# EAGLE design bt (EAGLE 6.4)
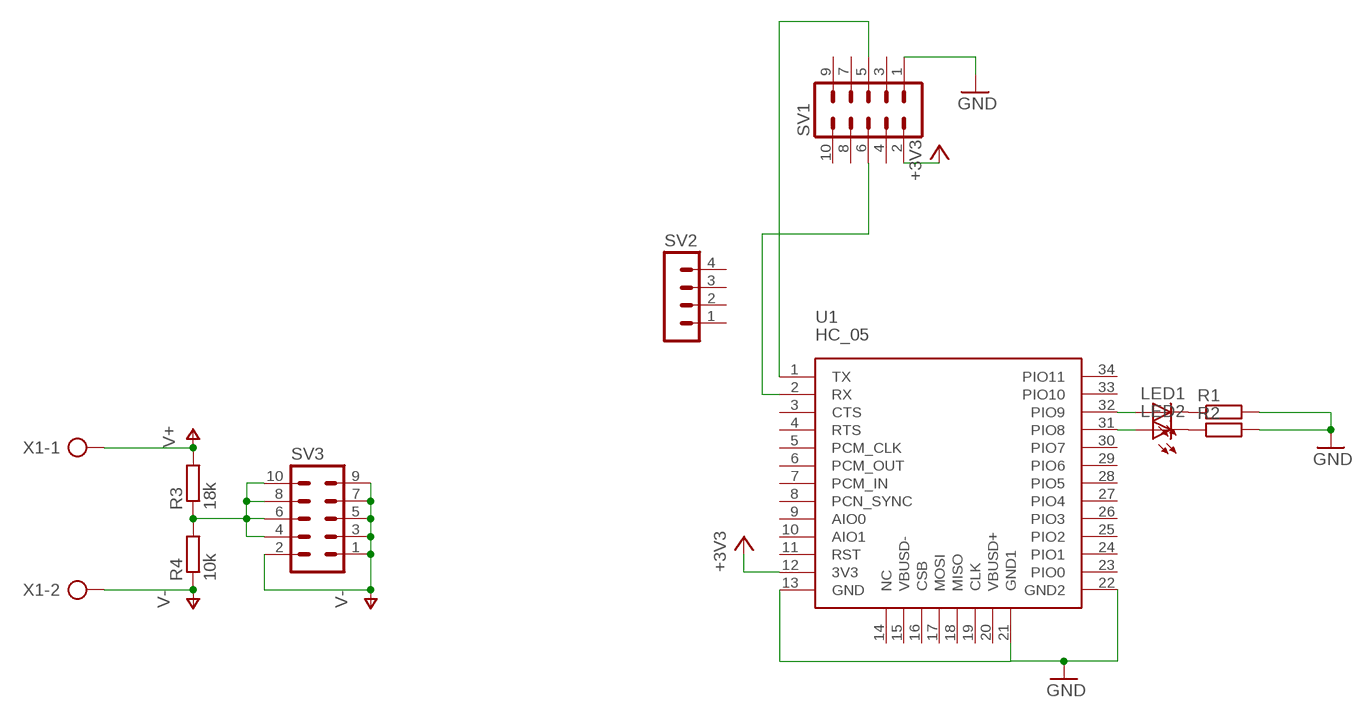
[diagram p0: schematic, sheet 1]

## Parts
LED1  LED3MM  [LED3MM]
LED2  LED3MM  [LED3MM]
R1  R-EU_R0805  [R0805]
R2  R-EU_R0805  [R0805]
R3  18k  R-EU_R0805  [R0805]
R4  10k  R-EU_R0805  [R0805]
SV1  ML10  [ML10]
SV2  MA04-1  [MA04-1]
SV3  ML10  [ML10]
U1  HC_05  [BLUETOOTH_SMD]
X1  AK500/2  [AK500/2]

## Nets
+3V3: SV1.2 U1.12(3V3)
GND: R1.2 R2.2 SV1.1 U1.13(GND) U1.21(GND1) U1.22(GND2)
N$1: SV1.5 U1.1(TX)
N$2: SV1.6 U1.2(RX)
N$3: LED1.K(C) R1.1
N$4: LED2.K(C) R2.1
N$5: LED2.A U1.31(PIO8)
N$6: LED1.A U1.32(PIO9)
N$9: R3.1 R4.2 SV3.4 SV3.6 SV3.8 SV3.10
V+: R3.2 X1.1
V-: R4.1 SV3.1 SV3.2 SV3.3 SV3.5 SV3.7 SV3.9 X1.2
Unconnected: SV1.3 SV1.4 SV1.7 SV1.8 SV1.9 SV1.10 SV2.1 SV2.2 SV2.3 SV2.4 U1.3(CTS) U1.4(RTS) U1.5(PCM_CLK) U1.6(PCM_OUT) U1.7(PCM_IN) U1.8(PCN_SYNC) U1.9(AIO0) U1.10(AIO1) U1.11(RST) U1.14(NC) U1.15(VBUSD-) U1.16(CSB) U1.17(MOSI) U1.18(MISO) U1.19(CLK) U1.20(VBUSD+) U1.23(PIO0) U1.24(PIO1) U1.25(PIO2) U1.26(PIO3) U1.27(PIO4) U1.28(PIO5) U1.29(PIO6) U1.30(PIO7) U1.33(PIO10) U1.34(PIO11)

## Library data of the parts
LED1 LED2 = led:LED: LED OSRAM: - CHIPLED LG R971, LG N971, LY N971, LG Q971, LY Q971, LO R971, LY R971 LH N974, LH R974 LS Q976, LO Q976, LY Q976 LO Q996 - Hyper CHIPLED LW Q18S LB Q993, LB Q99A, LB R99A - SideLED LS A670, LO A670, LY A670, LG A670, LP A670 LB A673, LV A673, LT A673, LW A673 LH A674 LY A675 LS A676, LA A676, LO A676, LY A676, LW A676 LS A679, LY A679, LG A679 - Hyper Micro SIDELED® LS Y876, LA Y876, LO Y876, LY Y876 LT Y87S - SmartLED LW L88C, LW L88S LB L89C, LB L89S, LG L890 LS L89K, LO L89K, LY L89K LS L896, LA L896, LO L896, LY L896 - TOPLED LS T670, LO T670, LY T670, LG T670, LP T670 LSG T670, LSP T670, LSY T670, LOP T670, LYG T670 LG T671, LOG T671, LSG T671 LB T673, LV T673, LT T673, LW T673 LH T674 LS T676, LA T676, LO T676, LY T676, LB T676, LH T676, LSB T676, LW T676 LB T67C, LV T67C, LT T67C, LS T67K, LO T67K, LY T67K, LW E67C LS E67B, LA E67B, LO E67B, LY E67B, LB E67C, LV E67C, LT E67C LW T67C LS T679, LY T679, LG T679 LS T770, LO T770, LY T770, LG T770, LP T770 LB T773, LV T773, LT T773, LW T773 LH T774 LS E675, LA E675, LY E675, LS T675 LS T776, LA T776, LO T776, LY T776, LB T776 LHGB T686 LT T68C, LB T68C - Hyper Mini TOPLED® LB M676 - Mini TOPLED Santana® LG M470 LS M47K, LO M47K, LY M47K Source: http://www.osram.convergy.de LUXEON: - LUMILED® LXK2-PW12-R00, LXK2-PW12-S00, LXK2-PW14-U00, LXK2-PW14-V00 LXK2-PM12-R00, LXK2-PM12-S00, LXK2-PM14-U00 LXK2-PE12-Q00, LXK2-PE12-R00, LXK2-PE12-S00, LXK2-PE14-T00, LXK2-PE14-U00 LXK2-PB12-K00, LXK2-PB12-L00, LXK2-PB12-M00, LXK2-PB14-N00, LXK2-PB14-P00, LXK2-PB14-Q00 LXK2-PR12-L00, LXK2-PR12-M00, LXK2-PR14-Q00, LXK2-PR14-R00 LXK2-PD12-Q00, LXK2-PD12-R00, LXK2-PD12-S00 LXK2-PH12-R00, LXK2-PH12-S00 LXK2-PL12-P00, LXK2-PL12-Q00, LXK2-PL12-R00 Source: www.luxeon.com KINGBRIGHT: KA-3528ASYC Source: www.kingbright.com
R1-R4 = resistor:R-EU_: RESISTOR, European symbol
SV1 SV3 = con-harting-ml:ML10: HARTING; OC_FARNELL: unknown; OC_NEWARK: unknown
SV2 = con-lstb:MA04-1: PIN HEADER; OC_FARNELL: unknown; OC_NEWARK: unknown
U1 = SerialPortBluetooth:HC_05
X1 = con-ptr500:AK500/2: CONNECTOR; OC_FARNELL: unknown; OC_NEWARK: unknown

## Board
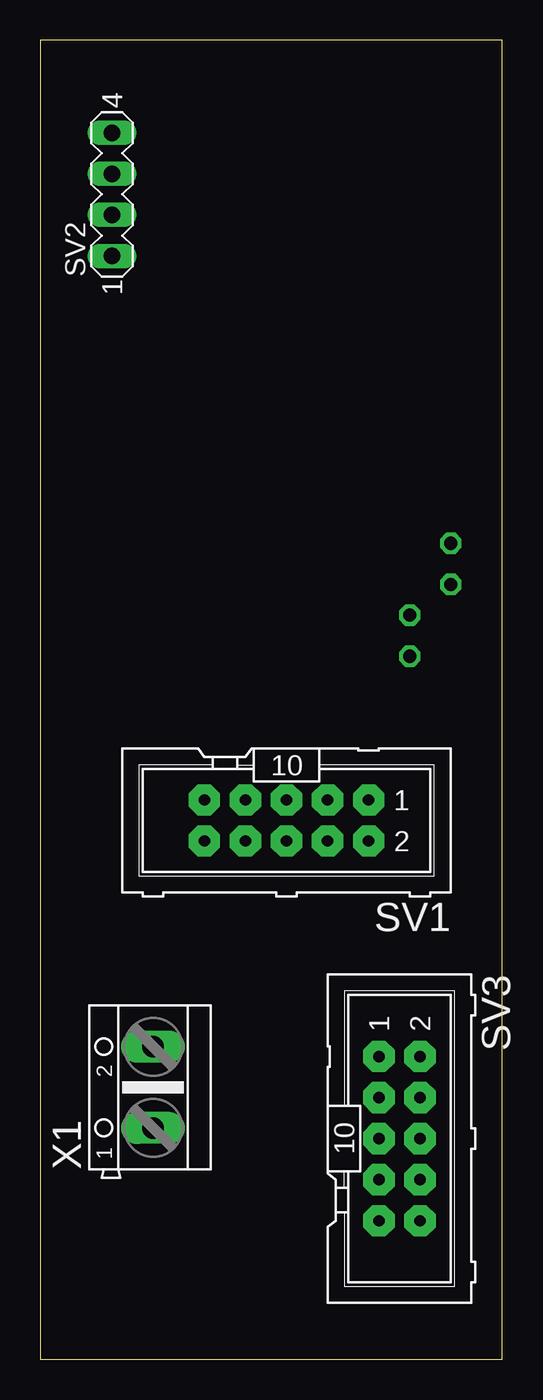
[diagram p1: board, top side]
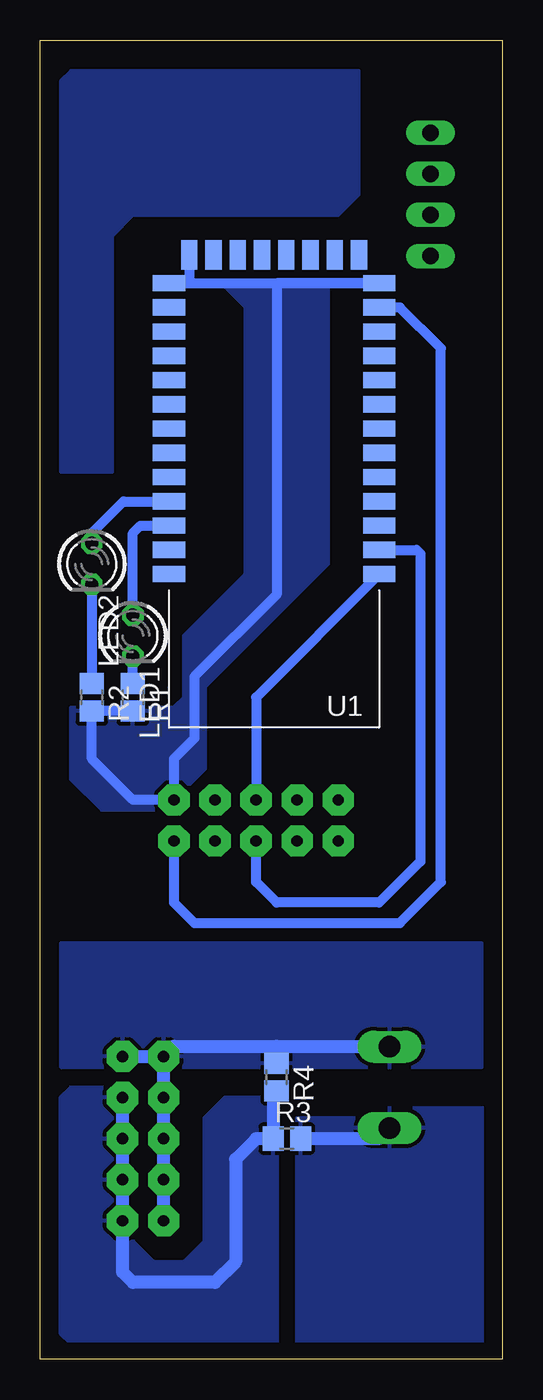
[diagram p2: board, bottom side, seen from below]

Size 28.55 x 81.59 mm. Coordinates in mm from the lower left corner, seen from the top.
Outline: 28.55,81.59 0,81.59 0,0 28.55,0 28.55,81.59
Copper layers (1*16): Top 0.035mm / dielectric 1.5mm / Bottom 0.035mm
Design rules "default": minimum track width 10mil, minimum drill 24mil, track to track 8mil, track to pad 8mil, pad to pad 8mil, via to via 8mil, smd to smd 8mil, copper to edge 40mil, drill to drill 8mil, minimum pad ring 10mil, minimum via ring 8mil, stop-mask expansion 4mil, vias tented up to drill 0mil, thermal gap 10mil

### Footprints (pad centres in the part's own frame; a part is rotated, then mirrored left to right if it is on the bottom)
LED3MM = drill 0.813 octagon: A -1.27,0; K 1.27,0
R0805 = smd 1.3 x 1.5: 1 -0.85,0; 2 0.85,0
ML10 = drill 0.7 pad 1.93 octagon: 1 -5.08,-1.27; 2 -5.08,1.27; 3 -2.54,-1.27; 4 -2.54,1.27; 5 0,-1.27; 6 0,1.27; 7 2.54,-1.27; 8 2.54,1.27; 9 5.08,-1.27; 10 5.08,1.27
MA04-1 = drill 1.016 long: 1 -3.81,0; 2 -1.27,0; 3 1.27,0; 4 3.81,0
BLUETOOTH_SMD = smd 2 x 1: 1 0,0; 2 0,-1.5; 3 0,-3; 4 0,-4.5; 5 0,-6; 6 0,-7.5; 7 0,-9; 8 0,-10.5; 9 0,-12; 10 0,-13.5; 11 0,-15; 12 0,-16.5; 13 0,-18; 22 13,-18; 23 13,-16.5; 24 13,-15; 25 13,-13.5; 26 13,-12; 27 13,-10.5; 28 13,-9; 29 13,-7.5; 30 13,-6; 31 13,-4.5; 32 13,-3; 33 13,-1.5; 34 13,0 | smd 1 x 1.8: 14 1.25,-19.75; 15 2.75,-19.75; 16 4.25,-19.75; 17 5.75,-19.75; 18 7.25,-19.75; 19 8.75,-19.75; 20 10.25,-19.75; 21 11.75,-19.75
AK500/2 = drill 1.321 long: 1 -2.515,0; 2 2.515,0

### Placement (x,y rotation side)
LED1  22.84,44.76 270 bottom
LED2  25.38,49.2 270 bottom
R1  22.84,40.95 270 bottom
R2  25.38,40.95 270 bottom
R3  13.32,13.64 0 bottom
R4  13.95,17.45 270 bottom
SV1  15.22,33.33 180 top
SV2  4.43,72.06 90 top
SV3  22.21,13.64 270 top
U1  7.6,48.57 180 bottom
X1  6.97,16.82 90 top

### Tracks (layer width: path | path; a pad name or v marks a point on that pad's centre or on a via)
+3V3
  Bottom 0.61: SV1.2 20.3,28.25 19.03,26.98 6.33,26.98 3.79,29.52 3.79,62.54 6.32,65.06 U1.12
GND
  Bottom 0.61: U1.22 19.35,66.56 | U1.21 19.35,66.56 | 19.35,66.56 U1.13 13.95,66.56 13.95,47.3 19.03,42.22 19.03,38.41 20.3,37.14 SV1.1 22.84,34.59 25.38,37.14 R2.2 R1.2
  pour Bottom: 20.3,33.96 24.75,33.96 26.65,35.87 26.65,40.31 20.3,40.31 19.66,40.95 19.66,44.76 15.86,48.57 15.86,65.08 17.12,66.34 10.78,66.34 10.78,49.2 18.39,41.58 18.39,36.5 19.66,35.23 19.66,34.59
N$1
  Bottom 0.61: U1.1 15.22,40.95 SV1.5
N$2
  Bottom 0.61: U1.2 5.29,50.07 5.06,49.84 5.06,30.79 7.6,28.25 13.95,28.25 15.22,29.52 SV1.6
N$3
  Bottom 0.61: R1.1 LED1.K
N$4
  Bottom 0.61: LED2.K R2.1
N$5
  Bottom 0.61: LED2.A 25.38,51.11 23.42,53.07 U1.31
N$6
  Bottom 0.61: LED1.A 22.84,51.11 22.38,51.57 U1.32
N$7
  pour Bottom: 24.11,54.91 24.11,69.52 22.84,70.79 10.14,70.79 8.87,72.06 8.87,79.68 26.65,79.68 27.29,79.05 27.29,54.91
N$9
  Bottom 0.813: SV3.4 SV3.6 SV3.8 SV3.10 23.48,5.38 22.84,4.75 17.76,4.75 16.49,6.02 16.49,12.37 15.22,13.64 R3.1 14.17,16.39 R4.2
  pour Bottom: 13.95,13.01 13.95,0.94 26.65,0.94 27.29,1.57 27.29,16.18 26.65,16.82 23.48,16.82 22.84,16.18 22.84,7.29 21.57,6.02 19.66,6.02 18.39,7.29 18.39,14.91 17.12,16.18 13.95,16.18
V+
  Bottom 0.813: X1.1 7.62,13.64 R3.2
  pour Bottom: 12.68,14.91 8.87,14.91 8.24,15.54 1.25,15.54 1.25,0.94 12.68,0.94
V-
  Bottom 0.813: SV3.2 SV3.1 | SV3.9 SV3.7 SV3.5 SV3.3 SV3.1 | X1.2 6.97,19.36 13.95,19.36 | SV3.1 20.3,19.36 13.95,19.36 | R4.1 13.95,19.36
  pour Bottom: 27.29,18.09 1.25,18.09 1.25,25.71 27.29,25.71